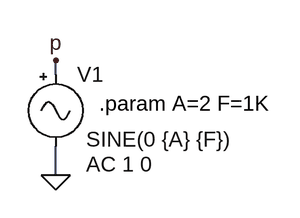
[diagram p0: schematic GenSinA.asc]
GenSinA.asc, the LTspice schematic file:
Version 4
SHEET 1 880 680
WIRE 32 112 32 96
WIRE 32 224 32 192
FLAG 32 96 p
FLAG 32 224 0
SYMBOL Misc\\signal 32 96 R0
WINDOW 123 34 116 Left 0
WINDOW 39 0 0 Left 0
WINDOW 3 34 88 Left 0
SYMATTR Value2 AC 1 0
SYMATTR InstName V1
SYMATTR Value SINE(0 {A} {F})
TEXT 80 144 Left 0 !.param A=2 F=1K

The netlist it stands for:
* GenSinA.asc
V1 p 0 SINE(0 {A} {F}) AC 1 0
.param A=2 F=1K
.backanno
.end